# EAGLE design PCB 111000_CA (EAGLE 9.0.1)
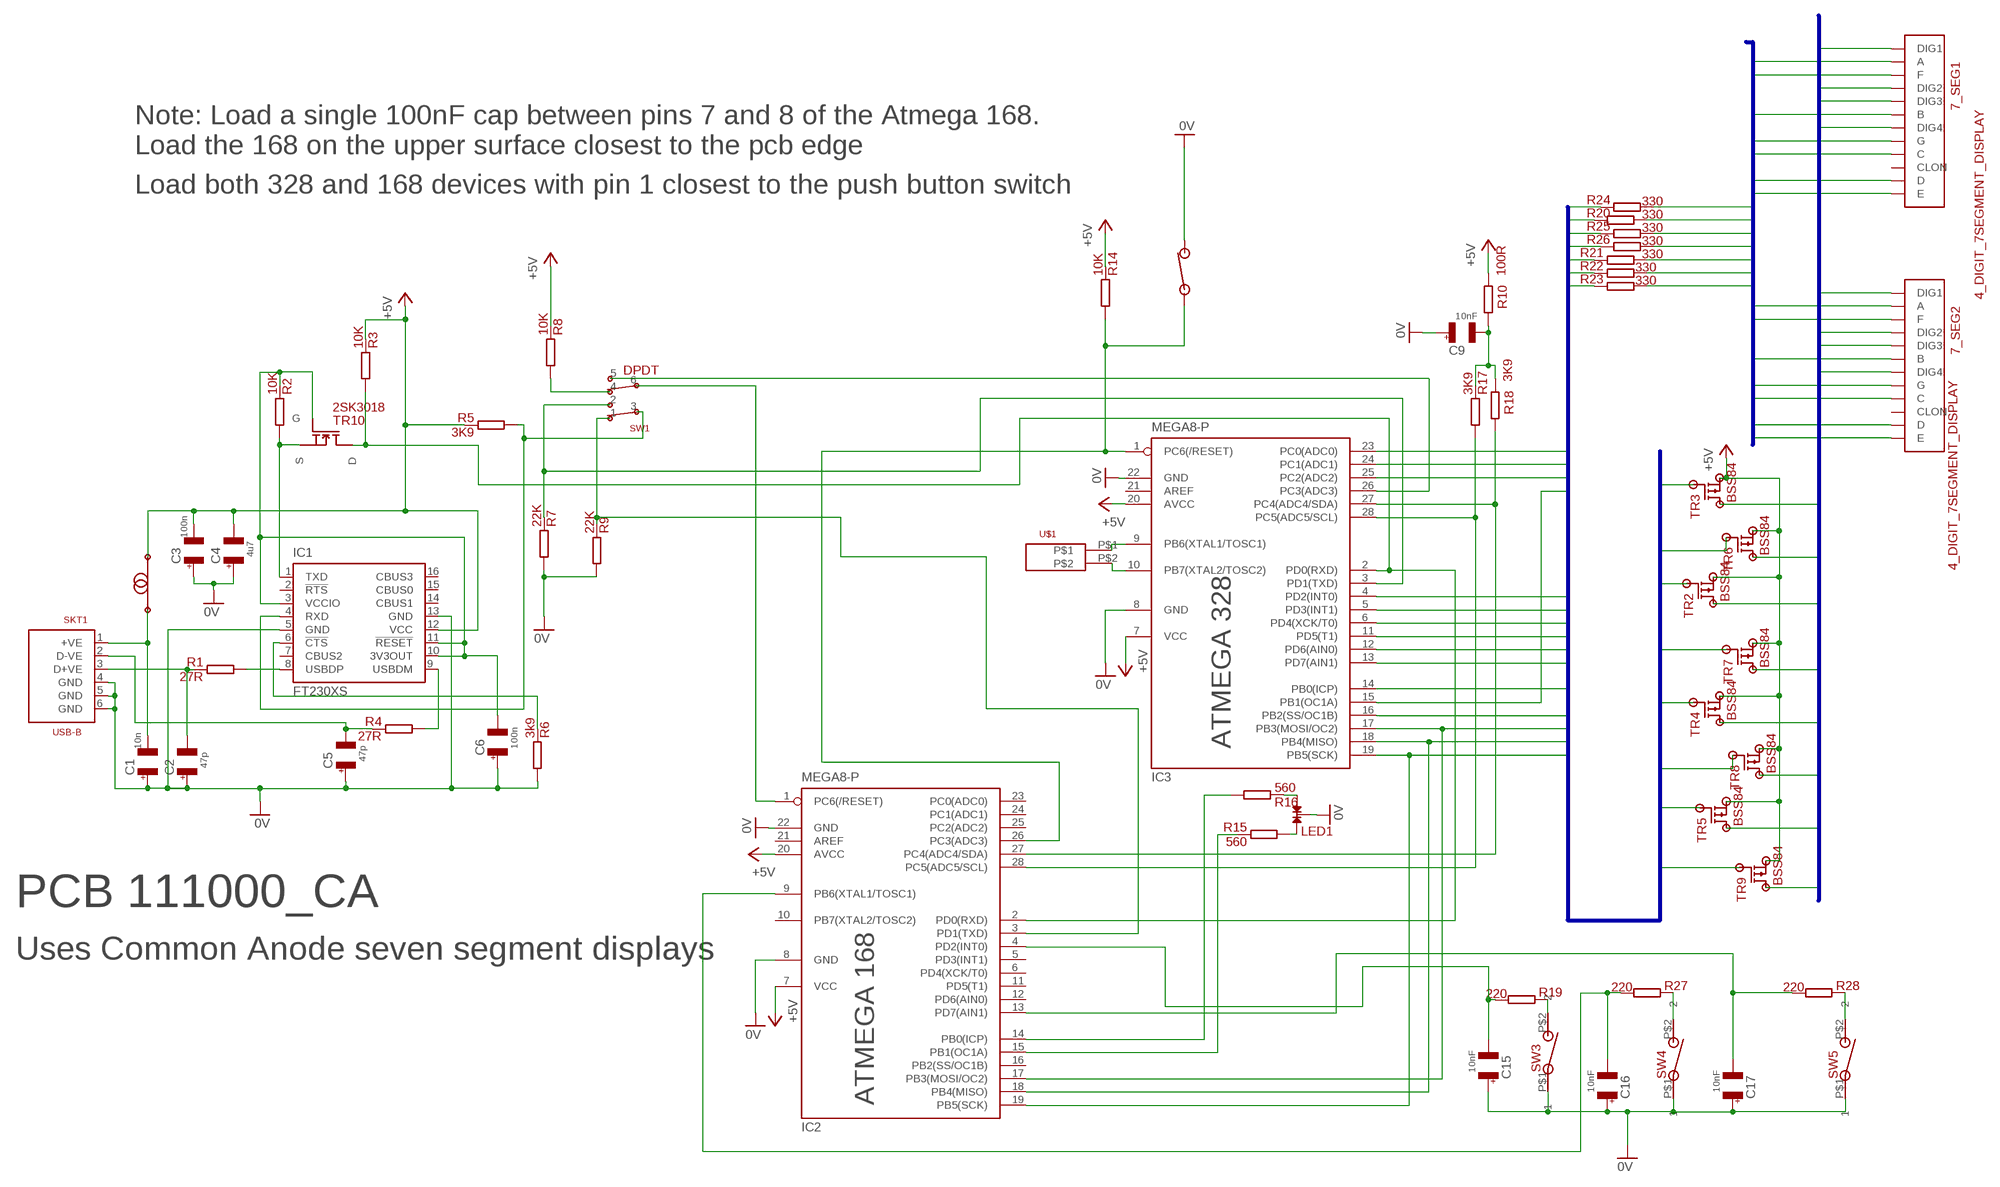
[diagram p0: schematic, sheet 1]

## Parts
7_SEG1  4_DIGIT_7SEGMENT_DISPLAY  [4_DIGIT_7SEGMENT_DISPLAY]
7_SEG2  4_DIGIT_7SEGMENT_DISPLAY  [4_DIGIT_7SEGMENT_DISPLAY]
C1  10n  1206C  [1206]
C2  47p  1206C  [1206]
C3  100n  1206C  [1206]
C4  4u7  1206C  [1206]
C5  47p  1206C  [1206]
C6  100n  1206C  [1206]
C9  10nF  1206C  [1206]
C15  10nF  1206C  [1206]
C16  10nF  1206C  [1206]
C17  10nF  1206C  [1206]
IC1  FT230XS  [SSOP16]
IC2  MEGA8-P  [DIL28-3]
IC3  MEGA8-P  [DIL28-3]
L1  CHOKE  [1206]
LED1  LED  [CA_DUAL_LED]
R1  27R  1206R  [1206]
R2  10K  1206R  [1206]
R3  10K  1206R  [1206]
R4  27R  1206R  [1206]
R5  3K9  1206R  [1206]
R6  3k9  1206R  [1206]
R7  22K  1206R  [1206]
R8  10K  1206R  [1206]
R9  22K  1206R  [1206]
R10  100R  1206R  [1206]
R14  10K  1206R  [1206]
R15  560  1206R  [1206]
R16  560  1206R  [1206]
R17  3K9  1206R  [1206]
R18  3K9  1206R  [1206]
R19  220  1206R  [1206]
R20  330  1206R  [1206]
R21  330  1206R  [1206]
R22  330  1206R  [1206]
R23  330  1206R  [1206]
R24  330  1206R  [1206]
R25  330  1206R  [1206]
R26  330  1206R  [1206]
R27  220  1206R  [1206]
R28  220  1206R  [1206]
SKT1  USB-B  [USB-B]
SW1  DPDT  [DPDT_SWITCH]
SW2  NO_SW  [SM_NO_PUSH_BUTTON]
SW3  NO_PB_1  [RE51-0711]
SW4  NO_PB_1  [RE51-0711]
SW5  NO_PB_1  [RE51-0711]
TR2  BSS84  [SOT23]
TR3  BSS84  [SOT23]
TR4  BSS84  [SOT23]
TR5  BSS84  [SOT23]
TR6  BSS84  [SOT23]
TR7  BSS84  [SOT23]
TR8  BSS84  [SOT23]
TR9  BSS84  [SOT23]
TR10  2SK3018  [2SK3018]
U$1  XTAL  [XTAL_VIAS]

## Nets
0V: C1.P$1 C2.P$1 C3.P$1 C4.P$1 C5.P$1 C6.P$1 C9.P$1 C15.P$1 C16.P$1 C17.P$1 IC1.5(GND) IC1.13(GND) IC2.8(GND) IC2.22(GND) IC3.8(GND) IC3.22(GND) LED1.2 R6.P$1 R7.P$1 R9.P$1 SKT1.4(GND) SKT1.5(GND) SKT1.6(GND) SW2.P$2 SW3.P$1 SW4.P$1 SW5.P$1
+5V: C3.P$2 C4.P$2 IC1.12(VCC) IC2.7(VCC) IC2.20(AVCC) IC3.7(VCC) IC3.20(AVCC) L1.P$2 R3.P$2 R5.P$2 R8.P$2 R10.P$2 R14.P$2 TR2.2(S) TR3.2(S) TR4.2(S) TR5.2(S) TR6.2(S) TR7.2(S) TR8.2(S) TR9.2(S)
DIGIT0: 7_SEG1.P$12(DIG1) TR4.3(D)
DIGIT1: 7_SEG1.P$9(DIG2) TR8.3(D)
DIGIT2: 7_SEG1.P$8(DIG3) TR5.3(D)
DIGIT3: 7_SEG1.P$6(DIG4) TR9.3(D)
DIGIT4: 7_SEG2.P$12(DIG1) TR3.3(D)
DIGIT5: 7_SEG2.P$9(DIG2) TR6.3(D)
DIGIT6: 7_SEG2.P$8(DIG3) TR2.3(D)
DIGIT7: 7_SEG2.P$6(DIG4) TR7.3(D)
DISPLAY_DRIVER0: IC3.15(PB1(OC1A)) R24.P$2
DISPLAY_DRIVER1: IC3.4(PD2(INT0)) R20.P$2
DISPLAY_DRIVER2: IC3.5(PD3(INT1)) R25.P$2
DISPLAY_DRIVER3: IC3.6(PD4(XCK/T0)) R26.P$2
DISPLAY_DRIVER4: IC3.11(PD5(T1)) R21.P$2
DISPLAY_DRIVER5: IC3.12(PD6(AIN0)) R22.P$2
DISPLAY_DRIVER6: IC3.13(PD7(AIN1)) R23.P$2
DISPLAY_DRIVER8: IC3.14(PB0(ICP)) TR3.1(G)
DISPLAY_DRIVER9: IC3.16(PB2(SS/OC1B)) TR6.1(G)
DISPLAY_DRIVER10: IC2.17(PB3(MOSI/OC2)) IC3.17(PB3(MOSI/OC2)) TR2.1(G)
DISPLAY_DRIVER11: IC2.18(PB4(MISO)) IC3.18(PB4(MISO)) TR7.1(G)
DISPLAY_DRIVER12: IC2.19(PB5(SCK)) IC3.19(PB5(SCK)) TR4.1(G)
DISPLAY_DRIVER13: IC3.23(PC0(ADC0)) TR8.1(G)
DISPLAY_DRIVER14: IC3.24(PC1(ADC1)) TR5.1(G)
DISPLAY_DRIVER15: IC3.25(PC2(ADC2)) TR9.1(G)
N$1: IC2.14(PB0(ICP)) R16.P$1
N$2: IC2.15(PB1(OC1A)) R15.P$2
N$3: LED1.1 R15.P$1
N$4: LED1.3 R16.P$2
N$5: IC3.26(PC3(ADC3)) SW1.5
N$6: IC3.3(PD1(TXD)) R7.P$2 SW1.2
N$7: R27.P$2 SW4.P$2
N$8: R19.P$2 SW3.P$2
N$9: C6.P$2 IC1.3(VCCIO) IC1.10(3V3OUT) IC1.11(!RESET) R2.P$2 TR10.2(G)
N$10: IC3.9(PB6(XTAL1/TOSC1)) U$1.P$1
N$11: C17.P$2 IC2.13(PD7(AIN1)) R28.P$1
N$12: IC3.10(PB7(XTAL2/TOSC2)) U$1.P$2
N$13: R8.P$1 SW1.4
N$14: IC2.3(PD1(TXD)) R9.P$2 SW1.1
N$15: IC1.1(TXD) R2.P$1 TR10.1(S)
N$16: R28.P$2 SW5.P$2
N$17: C15.P$2 IC2.4(PD2(INT0)) R19.P$1
N$18: IC1.9(USBDM) R4.P$1
N$19: C16.P$2 IC2.9(PB6(XTAL1/TOSC1)) R27.P$1
N$20: C9.P$2 R10.P$1 R17.P$2 R18.P$2
N$25: IC1.8(USBDP) R1.P$1
N$26: IC2.1(PC6(/RESET)) SW1.6
N$27: C5.P$2 R4.P$2 SKT1.2(D-VE)
N$29: C2.P$2 R1.P$2 SKT1.3(D+VE)
N$30: C1.P$2 L1.P$1 SKT1.1(+VE)
N$31: IC2.26(PC3(ADC3)) IC3.1(PC6(/RESET)) R14.P$1 SW2.P$1
N$34: IC1.6(!CTS) R6.P$2
N$35: IC1.4(RXD) R5.P$1 SW1.3
N$38: IC2.28(PC5(ADC5/SCL)) IC3.28(PC5(ADC5/SCL)) R17.P$1
N$39: IC2.27(PC4(ADC4/SDA)) IC3.27(PC4(ADC4/SDA)) R18.P$1
N$40: IC2.2(PD0(RXD)) IC3.2(PD0(RXD)) R3.P$1 TR10.3(D)
SEVEN_SEG0: 7_SEG1.P$11(A) 7_SEG2.P$11(A) R24.P$1
SEVEN_SEG1: 7_SEG1.P$7(B) 7_SEG2.P$7(B) R20.P$1
SEVEN_SEG2: 7_SEG1.P$4(C) 7_SEG2.P$4(C) R25.P$1
SEVEN_SEG3: 7_SEG1.P$2(D) 7_SEG2.P$2(D) R26.P$1
SEVEN_SEG4: 7_SEG1.P$1(E) 7_SEG2.P$1(E) R21.P$1
SEVEN_SEG5: 7_SEG1.P$10(F) 7_SEG2.P$10(F) R22.P$1
SEVEN_SEG6: 7_SEG1.P$5(G) 7_SEG2.P$5(G) R23.P$1
Unconnected: 7_SEG1.P$3(CLON) 7_SEG2.P$3(CLON) IC1.2(!RTS) IC1.7(CBUS2) IC1.14(CBUS1) IC1.15(CBUS0) IC1.16(CBUS3) IC2.5(PD3(INT1)) IC2.6(PD4(XCK/T0)) IC2.10(PB7(XTAL2/TOSC2)) IC2.11(PD5(T1)) IC2.12(PD6(AIN0)) IC2.16(PB2(SS/OC1B)) IC2.21(AREF) IC2.23(PC0(ADC0)) IC2.24(PC1(ADC1)) IC2.25(PC2(ADC2)) IC3.21(AREF)

## Buses
SEVEN_SEG[0..7]
DISPLAY_DRIVER[0..15]
DIGIT[0..7]

## Notes on the sheet
- Note: Load a single 100nF cap between pins 7 and 8 of the Atmega 168.
  Load the 168 on the upper surface closest to the pcb edge
- Load both 328 and 168 devices with pin 1 closest to the push button switch
- ATMEGA 328
- PCB 111000_CA
- Uses Common Anode seven segment displays
- ATMEGA 168

## Library data of the parts
7_SEG1 7_SEG2 = 1_marko:4_DIGIT_7SEGMENT_DISPLAY: Common Anode RE 55-1674
C1-C6 C9 C15-C17 = 1_Home_library:1206C: 4.7uF RS 538-2335 100nF RS 264-4179
IC1 = 1_3V3_Bootloader:FT230X: USB to BASIC UART IC RS 757-0010
IC2 IC3 = 1_Home_library:MEGA8-P: MICROCONTROLLER 8 Kbytes FLASH, 1 kbytes SRAM, 512 bytes EEPROM, USART, 4-channel 10 bit ADC, 2-channel 8 bit ADC Pin compatible with Atmega48, ATMega88, ATMega168 Source: avr.lbr; OC_FARNELL: unknown; OC_NEWARK: unknown
L1 = 1_Home_library:CHOKE: RS 724-1582 1206 inductor
LED1 = 3_My_prog:LED: RS228-5770
R1-R10 R14-R28 = 1_Home_library:1206R
SKT1 = 3_My_prog:USB-B: RS 515-1967
SW1 = 1_Home_library:DPDT: DPST switch RE 76-0100
SW2 = 1_Home_library:NO_SW: SM NO push button RE 51-0709
SW3-SW5 = 1_3V3_Bootloader:NO_PB_1: RE 51-0711
TR2-TR9 = 1_3V3_Bootloader:BSS84: RS 436-8091P
TR10 = 1_3V3_Bootloader:2SK3018: SM equivalent of 2N7000 RS 694-2812
U$1 = 1_3V3_Bootloader:XTAL: Watch Crystal RS 478-9268

## Board
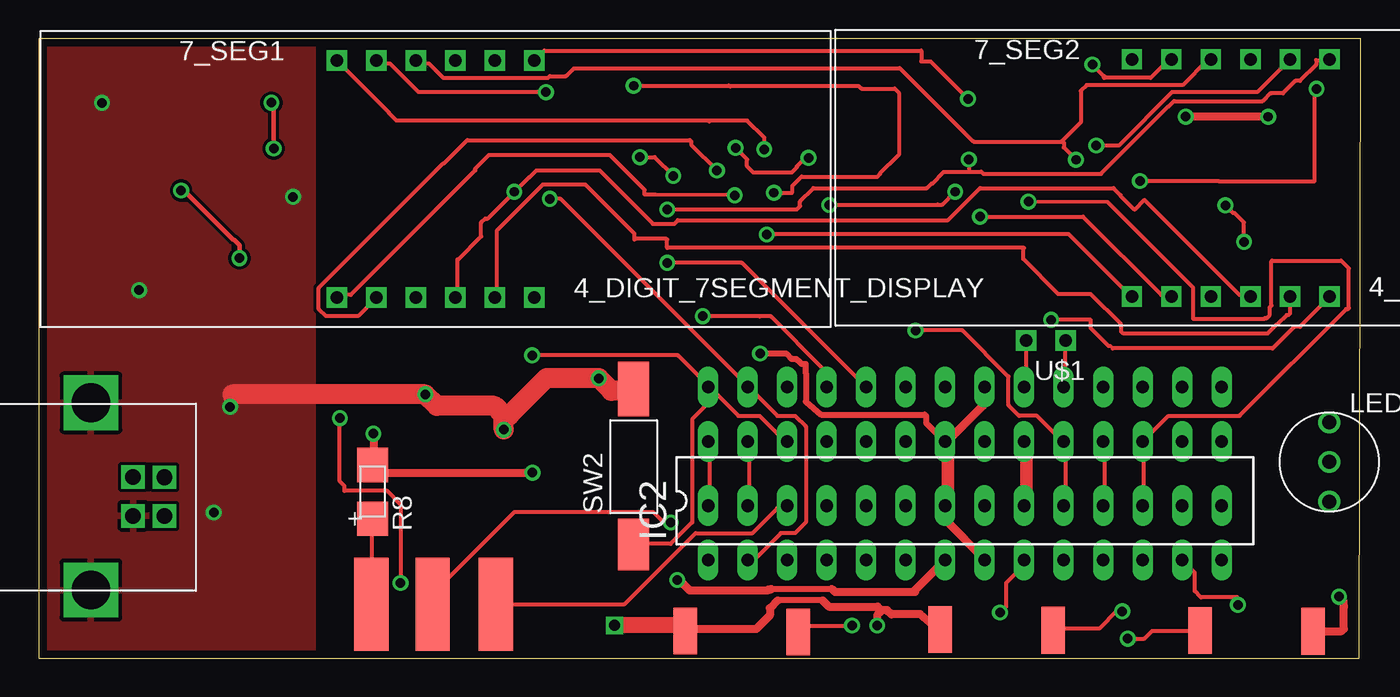
[diagram p1: board, top side]
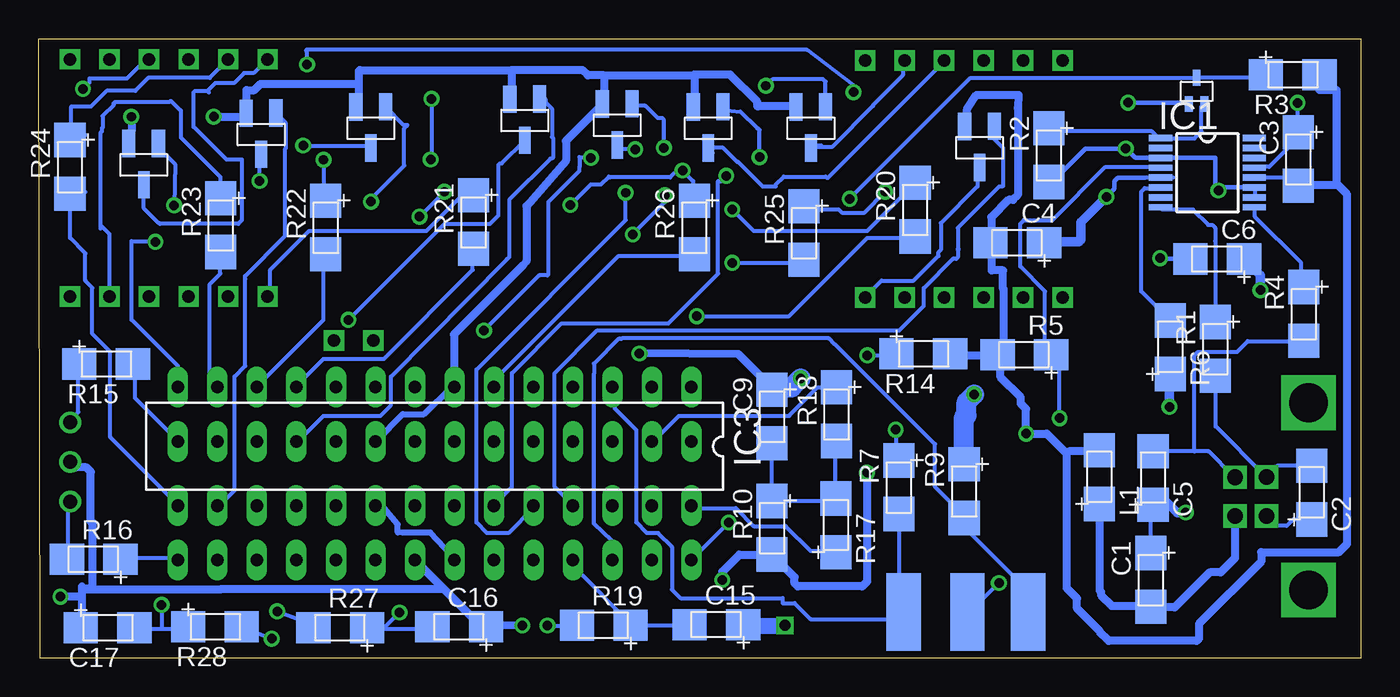
[diagram p2: board, bottom side, seen from below]

Size 85 x 39.8 mm. Coordinates in mm from the lower left corner, seen from the top.
Outline: 0,0 84.9,0 85,39.8 0,39.8 0,0
Copper layers (1*16): Top 0.035mm / dielectric 1.5mm / Bottom 0.035mm
Design rules "default *": minimum track width 10mil, minimum drill 24mil, track to track 8mil, track to pad 8mil, pad to pad 8mil, via to via 8mil, smd to smd 8mil, copper to edge 20mil, drill to drill 8mil, minimum pad ring 10mil, minimum via ring 8mil, stop-mask expansion 4mil, vias tented up to drill 0mil, thermal gap 10mil

### Footprints (pad centres in the part's own frame; a part is rotated, then mirrored left to right if it is on the bottom)
4_DIGIT_7SEGMENT_DISPLAY = drill 0.8 square: P$1 0,0; P$2 2.54,0; P$3 5.08,0; P$4 7.62,0; P$5 10.16,0; P$6 12.7,0; P$7 12.7,15.24; P$8 10.16,15.24; P$9 7.62,15.24; P$10 5.08,15.24; P$11 2.54,15.24; P$12 0,15.24
1206 = smd 2.2 x 2: P$1 -1.75,0; P$2 1.7,0
SSOP16 = smd 1.5 x 0.406: 1 -3.018,2.223; 2 -3.018,1.587; 3 -3.018,0.953; 4 -3.018,0.318; 5 -3.018,-0.318; 6 -3.018,-0.953; 7 -3.018,-1.587; 8 -3.018,-2.223; 9 3.018,-2.223; 10 3.018,-1.587; 11 3.018,-0.953; 12 3.018,-0.318; 13 3.018,0.318; 14 3.018,0.953; 15 3.018,1.587; 16 3.018,2.223
DIL28-3 = drill 0.813 long: 1 -16.51,-3.81; 2 -13.97,-3.81; 3 -11.43,-3.81; 4 -8.89,-3.81; 5 -6.35,-3.81; 6 -3.81,-3.81; 7 -1.27,-3.81; 8 1.27,-3.81; 9 3.81,-3.81; 10 6.35,-3.81; 11 8.89,-3.81; 12 11.43,-3.81; 13 13.97,-3.81; 14 16.51,-3.81; 15 16.51,3.81; 16 13.97,3.81; 17 11.43,3.81; 18 8.89,3.81; 19 6.35,3.81; 20 3.81,3.81; 21 1.27,3.81; 22 -1.27,3.81; 23 -3.81,3.81; 24 -6.35,3.81; 25 -8.89,3.81; 26 -11.43,3.81; 27 -13.97,3.81; 28 -16.51,3.81
CA_DUAL_LED = drill 0.9: 1 0,2.54; 2 0,0; 3 0,-2.54
USB-B = drill 1 square: 1 2.475,0.02; 2 -0.01,0.015; 3 -0.03,-2; 4 2.47,-2 | drill 2.5 square: 5 -4.8,-4.71; 6 7.24,-4.71
DPDT_SWITCH = smd 2.2 x 5: 1 -0.87,1.5; 2 7.13,1.5; 3 3.03,1.5 | smd 2.2 x 6 bottom: 4 -0.87,1; 5 7.13,1; 6 3.07,1
SM_NO_PUSH_BUTTON = smd 3.3 x 2: P$1 -2,1.5 | smd 3.5 x 2: P$2 8,1.5
RE51-0711 = smd 1.5 x 3: P$1 0.77,1.48; P$2 8.03,1.43
SOT23 = smd 0.85 x 1.75: 1 0.56,-2.08; 2 2.47,-2.07 | smd 0.75 x 1.75: 3 1.5,0.57
2SK3018 = smd 0.5 x 1: 1 0.5,-0.8; 2 -0.5,-0.8; 3 0,0.9
XTAL_VIAS = drill 0.8 square: P$1 0,1.27; P$2 0,-1.27

### Placement (x,y rotation side)
7_SEG1  19.16,23.17 0 top
7_SEG2  70.29,23.25 0 top
C1  13.5,5 270 bottom
C2  3.15,10.65 90 bottom
C3  4,32.05 270 bottom
C4  22.1,26.7 180 bottom
C5  13.35,11.6 90 bottom
C6  9.25,25.65 180 bottom
C9  37.85,15.5 270 bottom
C15  41.45,2.15 180 bottom
C16  58,2 180 bottom
C17  80.55,1.95 0 bottom
IC1  9.85,31.2 0 bottom
IC2  59.55,10.1 0 top
IC3  59.55,13.6 180 bottom
L1  16.8,11.65 90 bottom
LED1  82.99,12.6 0 top
R1  9.35,19.85 270 bottom
R2  20.05,32.3 270 bottom
R3  4.35,37.5 0 bottom
R4  3.65,22.1 270 bottom
R5  21.65,19.5 180 bottom
R6  12.25,20 90 bottom
R7  29.7,10.95 270 bottom
R8  21.45,10.7 90 top
R9  25.5,10.7 270 bottom
R10  37.85,8.35 270 bottom
R14  28.1,19.55 0 bottom
R15  80.65,18.9 0 bottom
R16  81.5,6.35 180 bottom
R17  33.75,8.55 90 bottom
R18  33.7,15.65 270 bottom
R19  48.7,2.1 180 bottom
R20  28.65,28.8 270 bottom
R21  57.05,28 270 bottom
R22  66.55,27.65 270 bottom
R23  73.3,27.8 270 bottom
R24  83,31.55 270 bottom
R25  35.8,27.3 270 bottom
R26  42.85,27.65 270 bottom
R27  65.65,1.95 180 bottom
R28  73.65,2 0 bottom
SKT1  8.06,11.61 270 top
SW1  22.25,4.45 180 bottom
SW2  39.75,9.3 90 top
SW3  40.8,0.25 0 top
SW4  57.2,0.35 0 top
SW5  82.7,3.2 180 top
TR2  62.15,33.35 180 bottom
TR3  76.75,31 180 bottom
TR4  46.3,33.55 180 bottom
TR5  33.85,33.35 180 bottom
TR6  69.2,32.95 180 bottom
TR7  52.25,33.85 180 bottom
TR8  40.45,33.35 180 bottom
TR9  23,32.1 180 bottom
TR10  10.55,36.4 0 bottom
U$1  64.75,20.4 90 top

### Tracks (layer width: path | path; a pad name or v marks a point on that pad's centre or on a via)
0V  (via drill 0.61, 0.7)
  Top 0.254: 41.78,1.85 SW3.P$1 41.19,2.11 | 57.78,1.85 SW4.P$1 | 81.78,1.85 SW5.P$1 | 82.93,12.6 LED1.2 | 58.47,9.86 IC3.22 58.47,9.63 | 58.47,13.74 IC2.22 | 60.75,16.26 60.75,17.4 IC3.8 | 58.47,13.97 IC2.22 | 60.75,6.43 IC2.8 | 57.78,13.97 58.24,13.97 IC2.22 | 48.41,19.23 48.41,19.24 | 46.41,19.55 v46.38,19.58 | 54.94,2.82 54.92,2.82 | 56.66,2.82 54.81,2.82 | 38.12,17.17 37.44,16.49 SW2.P$2 38.12,17.17
  Top 0.4: 50.4,3.7 47.5,3.7 | 46.41,19.55 48.1,19.55 48.41,19.24 | 48.41,19.23 48.7,19.23 48.8,19.13 48.83,19.13 49.05,18.91 49.3,18.91 49.3,18.34 49.32,18.31 49.32,16.49 50.31,15.64 56.96,15.64 57.06,15.55 57.06,15.13 IC2.22
  Top 0.5: 41.78,1.85 46.12,1.85 47,2.73 47,3.2 47.5,3.7 | 57.78,1.85 56.66,2.82 54.94,2.82 | 58.47,13.97 60.75,16.26 | 58.47,9.63 58.47,8.71 60.75,6.43 | 50.4,3.7 50.8,3.3 53.93,3.3 54.14,3.09 | 54.55,3.09 54.14,3.09 | 54.14,3.09 54.14,2.98 53.91,2.74 v53.91,2.09 | SW5.P$1 83.77,1.72 83.92,1.88 83.92,3.33 83.92,3.34 83.92,3.63 v83.61,3.94
  Top 0.56: 54.81,2.82 54.55,3.09
  Top 0.61: 12.45,16.95 12.3,17.1 v12.3,16.15
  Top 0.8: 58.47,13.74 58.47,9.86
  Top 1.016: 41.19,2.11 37.03,2.11 v37.02,2.09
  Top 1.27: 12.45,16.95 v24.85,16.95 25.6,16.2 29.3,16.2 29.9,15.6 | v29.9,14.68 29.9,15.6 | 29.9,15.6 30.25,15.6 32.65,18 35.99,18 v36.01,17.98 36.82,17.17 38.12,17.17
  Bottom 0.254: 82.24,2.08 C17.P$1 82.3,3.93 82.28,3.95 | 60.75,6.43 IC2.8 60.82,6.27 58.97,4.41 | 40.63,2.08 39.72,2.08 C15.P$1 | 56.18,1.85 C16.P$1 56.41,2.08 56.64,2.08 56.64,2.11 53.95,2.11 53.92,2.08 v53.92,2.09 | 12.06,30.89 12.75,30.89 IC1.5 12.98,30.89 13.89,30.89 | 7.72,26.54 7.72,25.86 C6.P$1 | 20.29,26.77 C4.P$1 | v29.9,14.68 29.89,12.83 R7.P$1 | 37.66,17.4 C9.P$1 37.89,17.4 | IC1.13 6.8,31.57 5.89,31.57 3.83,33.63 C3.P$1 4.06,33.86 v4.06,35.69 | 2.46,8.71 C2.P$1 4.35,8.9 4.75,8.5 5.45,8.5 5.89,8.94 SKT1.4 6.12,9.17 | 13.66,6.43 C1.P$1 13.5,9.24 13.66,9.4 13.43,9.63 C5.P$1 | 12.75,10.31 13.2,9.86 C5.P$1 | 13.43,9.86 C5.P$1 | 73.34,4.41 73.36,4.4 | 82.24,4.6 81.84,4.6 81.54,4.4 | 81.54,8.72 81.67,8.75 | v83.61,3.95 v83.61,3.94 | 36.97,2.08 v37.02,2.09
  Bottom 0.305: 13.89,30.89 15.61,30.89 15.85,30.65 15.85,30.15 v16.35,29.65
  Bottom 0.5: 82.24,4.6 82.24,4.4 | 82.24,4.4 82.24,2.08 | v46.38,19.58 40.02,19.53 37.89,17.4 | 56.64,2.11 IC2.8 | v53.91,2.09 55.44,2.09 55.46,2.12 56.14,2.12 C16.P$1 | 58.97,4.41 73.34,4.41 | 73.36,4.4 82.24,4.4 | 81.54,4.4 81.54,8.72 | 81.67,8.75 81.67,11.97 81.95,12.26 82.64,12.26 LED1.2 | 82.28,3.95 v83.61,3.95
  Bottom 0.61: 20.29,26.77 18.13,26.77 18,26.9 18,28 v16.35,29.65 | v11.25,9.35 11.78,9.35 12.75,10.31 | v12.3,16.15 12.3,18.2 R6.P$1 | 25.5,15.5 25.4,15.6 25.35,15.6 | v6.45,23.65 6.45,24.6 C6.P$1
  Bottom 1.016: 39.72,2.08 36.97,2.08
  Bottom 1.27: R9.P$1 25.5,15.5 | 25.35,15.6 25.35,16.45 v24.85,16.95 | 37.66,17.4 36.59,17.4 v36.01,17.98
  pour Top: 0.4,40.05 17.6,40.05 17.6,0.5 0.4,0.5
+5V  (via drill 0.61)
  Top 0.254: 21.66,12.37 R8.P$2 | 63.5,9.86 IC3.20 | 63.5,13.74 IC2.20 | 58.24,6.2 IC2.7
  Top 0.4: 47.1,4.45 51,4.45
  Top 0.5: v21.51,14.42 21.51,12.46 R8.P$2 21.48,11.87 31.7,11.87 v31.74,11.91 | v41.05,5.01 41.19,5.01 41.85,4.35 46.85,4.35 46.9,4.4 47.05,4.4 47.1,4.45 | 51,4.45 51.2,4.25 56.35,4.25 56.35,4.36 IC2.7 | v79.05,34.8 v73.75,34.8
  Top 0.8: 63.5,13.74 63.5,9.86
  Bottom 0.254: IC1.12 6.8,30.89 4.52,30.89 4.06,30.43 C3.P$2 | 2.46,37.29 R3.P$2 2.65,36.5 | 3.83,30.43 C3.P$2 | 25.32,34.09 TR9.2 | 23.72,26.77 C4.P$2 23.72,26.54 23.72,26.17 | 26.95,18.97 26.46,19.46 R14.P$2 26.23,19.46 | 16.86,13.28 L1.P$2 | 23.49,19.46 R5.P$2 23.26,19.69 22.95,19.84 | 3.83,30.2 C3.P$2 | 58.47,17.4 IC3.7 | 63.27,13.97 IC2.20 | 37.89,6.43 R10.P$2 37.66,6.43 | 63.27,9.63 IC3.20 | 58.47,6.43 IC2.7 | 71.5,35.23 TR6.2 | 79.04,33.86 79.04,33.17 TR3.2 | 71.95,34.77 71.72,35 TR6.2 | 36.52,35.46 TR5.2 | 48.64,35.69 TR4.2 | 42.92,35.46 TR8.2 | 54.58,36.14 TR7.2 | 48.87,35.69 TR4.2 | 64.41,35.46 TR2.2 | 58.24,17.63 IC3.7 | TR4.2 48.87,35.46 48.89,35.46 | 48.7,35.69 TR4.2 | 71.65,35.95 71.65,35.04 TR6.2 | 1.6,30.43 1.6,30.4 1.55,30.4 1.55,30.5 | 53.65,25.5 53.85,25.3 53.85,25.25 | 58.3,17.43 IC3.7
  Bottom 0.4: 58.47,17.4 60.23,15.68 61.6,15.68 63.27,13.97 | 63.27,9.63 62.81,9.63 61.92,8.58 61.92,8.08 61.62,8.06 59.83,8.06 58.47,6.58 58.47,6.43
  Bottom 0.5: 26.23,19.46 23.49,19.46 | 22.95,19.84 22.95,23.73 23.01,23.73 23.01,24.92 23.72,24.92 23.72,26.17 | v79.05,34.8 79.04,33.86 | 3.83,30.43 1.6,30.43 | 2.65,36.5 1.55,36.5 1.55,30.5 0.86,29.81 0.86,7.34 1.4,6.8 6.4,6.8 6.4,6.2 10.4,2.2 10.4,1.25 10.55,1.1 16.2,1.1 16.8,1.7 16.8,1.75 18.23,3.18 18.23,3.83 18.9,4.5 18.9,13.13 | 16.86,13.28 18.75,13.28 18.9,13.13 | 18.9,13.13 20.19,14.42 v21.51,14.42 21.51,16.01 21.85,16.35 21.85,16.75 23.15,18.05 23.15,19.3 R5.P$2 | v31.74,11.91 31.74,4.91 32.05,4.6 36.2,4.6 36.4,4.8 36.4,5.2 R10.P$2 39.95,6.65 41.05,5.55 v41.05,5.01 | 25.32,34.09 25.32,35.28 24.7,36.2 22,36.2 22.05,35.35 22.05,29.75 22.35,29.45 22.65,29.45 23.75,28.35 23.75,26.75 C4.P$2 | 48.89,35.46 51.1,33.25 51.1,31.95 53.65,29.05 53.65,25.5 | 36.52,35.46 38.76,35.46 38.8,35.5 38.8,35.75 40.55,37.5 42.85,37.5 42.85,37.35 | 42.85,37.35 42.85,35.49 TR8.2 | 48.64,35.69 48.64,37.44 48.65,37.45 | 48.65,37.45 42.95,37.45 42.85,37.35 | 48.65,37.45 49.7,37.45 50.05,37.8 54.6,37.8 | 54.6,37.8 54.6,36.04 TR7.2 | 64.41,35.46 64.41,36.85 | 64.41,36.85 64.41,37.74 64.35,37.8 54.6,37.8 | 71.65,35.95 71.65,36.5 71.15,36.5 70.75,36.9 64.46,36.9 64.41,36.85 | v73.75,34.8 71.89,34.8 TR6.2 | 53.85,25.25 58.3,20.8 58.3,17.43
DIGIT0  (via drill 0.61)
  Top 0.254: 19.38,38.2 7_SEG1.P$12 22.5,35.08 22.5,35.05 23,34.55 43.15,34.55 | 43.1,34.5 43.15,34.55 | v46.65,32.7 46.65,33.45 45.55,34.55 43.15,34.55
  Bottom 0.254: v46.65,32.7 47.52,32.7 TR4.3
DIGIT1
  Bottom 0.254: 41.78,32.72 TR8.3 | 7_SEG1.P$9 26.92,38.2 34.27,30.85 34.3,30.85 34.4,30.95 37.1,30.95 37.6,30.45 37.6,30.3 38.45,30.3 40.05,31.9 40.1,31.9 41,32.8 41.93,32.8 TR8.3 | 41.65,32.48 TR8.3 | 41.78,32.95 TR8.3 | 41.9,32.73 TR8.3
DIGIT2
  Bottom 0.254: 34.69,32.94 35.15,32.94 TR5.3 35.28,32.85 34,32.85 31.35,35.5 31.35,35.55 29.43,37.47 29.43,38.2 7_SEG1.P$8
DIGIT3
  Bottom 0.254: TR9.3 24.63,31.34 24.63,30.32 27,27.95 27,26.23 27.15,26.09 27.15,25.86 28.75,24.26 30.81,24.26 31.72,23.34 7_SEG1.P$6
DIGIT4
  Bottom 0.254: 78.13,30.2 TR3.3 78.25,28.9 77.3,27.95 77.25,27.95 77.22,27.92 72.18,27.92 71.95,28.14 71.95,32.03 72.93,32.03 75.05,34.15 75.05,36.35 74.95,36.45 74.15,36.45 | 70.35,38.43 7_SEG2.P$12 70.31,38.49 71.2,37.6 71.8,37.6 72.45,36.95 73.65,36.95 74.15,36.45 | 74.15,36.45 74.05,36.35
DIGIT5  (via drill 0.61)
  Top 0.254: v70.81,30.66 75.84,30.66 75.85,30.65 82.05,30.65 82.05,36.47 v82.17,36.59
  Bottom 0.254: v70.81,30.66 70.81,32.26 TR6.3 | 7_SEG2.P$9 78.13,38.43 78.17,38.43 79.35,37.25 81.75,37.25 81.75,37.01 v82.17,36.59
DIGIT6  (via drill 0.61)
  Top 0.254: v68,32.94 69.44,32.94 72.87,36.37 78.35,36.37 80.41,38.43 7_SEG2.P$8
  Bottom 0.254: v68,32.94 63.72,32.94 TR2.3
DIGIT7  (via drill 0.61)
  Top 0.254: v65.1,21.74 67.65,21.74 67.65,21.2 68.8,20.05 68.9,20.05 69.05,19.9 79.35,19.9 80.74,21.29 81.1,21.29 82.93,23.12 7_SEG2.P$6
  Bottom 0.254: v65.1,21.74 58.92,27.92 55.98,27.92 55.45,28.45 55.45,31.7 55.35,31.8 55.23,31.8 TR7.3 53.89,33.17
DISPLAY_DRIVER0
  Bottom 0.254: 82.01,29.97 R24.P$2 83,27 82.01,26.01 82.01,24.26 81.56,23.8 81.56,20.83 80.41,19.69 80.41,14.2 76.07,9.86 IC3.15
DISPLAY_DRIVER1  (via drill 0.61)
  Top 0.254: v42.69,21.97 46.35,21.97 46.36,21.97 47.06,21.97 50.47,18.56 50.53,18.56 50.69,18.4 50.69,17.63 IC3.4
  Bottom 0.254: v42.69,21.97 36.75,21.97 31.72,27 28.75,27 R20.P$2
DISPLAY_DRIVER2  (via drill 0.61)
  Top 0.254: v40.41,25.4 45.21,25.4 52.98,17.63 IC3.5
  Bottom 0.254: v40.41,25.4 35.84,25.4 R25.P$2
DISPLAY_DRIVER3
  Bottom 0.254: R26.P$2 42.92,25.86 47.72,25.86 55.95,17.63 IC3.6
DISPLAY_DRIVER4
  Bottom 0.254: R21.P$2 57.09,26.09 57.09,24.94 62.81,19.23 66.7,19.23 68.3,17.63 IC3.11
DISPLAY_DRIVER5
  Bottom 0.254: R22.P$2 66.7,25.86 66.7,21.74 70.81,17.63 IC3.12
DISPLAY_DRIVER6
  Bottom 0.254: R23.P$2 73.33,26.09 73.33,24.72 74.01,24.03 74.01,18.09 73.55,17.63 IC3.13
DISPLAY_DRIVER8  (via drill 0.61)
  Top 0.254: v77.5,26.75 77.5,28 76.9,28.6 76.8,28.6 v76.3,29.1
  Bottom 0.254: TR3.1 77.44,32.94 76.25,31.75 v76.3,29.1 | IC3.14 76.07,17.63 76.07,18.77 79.04,21.74 79.04,26.8 78.99,26.75 v77.5,26.75
DISPLAY_DRIVER9
  Bottom 0.254: 69.9,35 TR6.1 69.1,34.37 69.1,32.8 69.15,32.75 69.15,27.15 71.75,24.55 71.75,24.4 71.72,24.38 71.72,18.77 72.41,18.09 72.41,10.77 73.33,9.86 IC3.16
DISPLAY_DRIVER10  (via drill 0.61)
  Top 0.254: v63.64,29.34 68.75,29.29 74.24,23.8 74.24,21.81 74.25,21.8 78.8,21.8 78.85,21.85 78.95,21.85 79.15,22.05 79.15,22.54 79.27,22.66 79.27,25.52 79.3,25.55 83.75,25.55 84.25,25.05 84.25,22.5 84.18,22.43 84.07,22.43 77.21,15.57 72.64,15.57 71.04,13.97 IC2.17 71.04,13.74 71.04,9.86 IC3.17
  Bottom 0.254: 62.81,35.23 TR2.1 61.53,34.25 61.3,34.25 61.5,34.05 61.5,31.65 63.64,29.51 v63.64,29.34
DISPLAY_DRIVER11
  Top 0.254: IC3.18 68.53,9.86 68.53,13.74 IC2.18
  Bottom 0.254: 52.98,35.92 TR7.1 52.43,35.93 52.43,35.73 52,35.3 52,33.5 51.95,33.45 51.95,32.15 52,32.1 52.1,32.1 54.75,29.45 54.75,25.79 54.89,25.64 62.35,18.09 62.35,16.26 63.04,15.57 66.7,15.57 68.3,13.97 IC2.18
DISPLAY_DRIVER12  (via drill 0.61)
  Top 0.254: v56.37,21.06 59.38,21.06 62.35,18.09 62.35,16.26 63.04,15.57 64.18,15.57 65.78,13.97 IC2.19 66.01,13.74 66.01,9.86 IC3.19 | v49.5,32.15 49.3,32.15 48.75,31.6 48.75,31.55 48.4,31.2 45.95,31.2 45.55,31.6 45.55,32.05 v44.8,32.8
  Bottom 0.254: 47.04,35.46 TR4.1 46.73,35.5 46,35.5 45.2,34.7 44.9,34.7 44.8,34.6 v44.8,32.8 | v49.5,32.15 50.19,32.15 50.24,32.2 50.24,31.56 50.25,31.55 50.25,31.3 52.25,29.3 52.25,24.65 52.3,24.6 52.83,24.6 v56.37,21.06
DISPLAY_DRIVER13  (via drill 0.61)
  Top 0.254: v38.65,32.2 39.6,32.2 v40.8,31
  Bottom 0.254: TR8.1 41.09,35.23 39.88,35.13 38.8,34.05 38.75,34.05 38.65,33.95 v38.65,32.2 | IC3.23 55.72,9.86 54.58,11 54.58,18.31 51.38,21.52 44.52,21.52 41.32,24.72 41.32,30.66 41.14,30.66 v40.8,31
DISPLAY_DRIVER14  (via drill 0.61)
  Top 0.254: v38.25,36.8 v38.25,36.79 44.36,36.79 44.45,36.75 52.75,36.75 52.9,36.6 55.05,36.6 55.3,36.35 55.3,32.35 54.1,31.15 54.1,31.1 53.95,30.95 49.05,30.95 48.45,30.35 48.45,29.95 48.41,29.91 v47.27,29.91 | v38.25,36.8
  Bottom 0.254: v47.27,29.91 47.27,28.14 56.87,18.54 56.87,8.71 56.18,8.03 54.81,8.03 53.21,9.63 IC3.24 | 34.46,35.23 TR5.1 34.41,37.06 34.55,37.2 37.84,37.2 v38.25,36.79
DISPLAY_DRIVER15
  Bottom 0.254: 23.72,34.32 TR9.1 23.56,33.36 23,32.8 23,30.35 23.05,30.3 23.25,30.3 25.9,27.65 25.9,26.3 25.85,26.25 25.85,26.3 25.9,26.25 25.9,25.75 26,25.65 26.21,25.65 28.09,23.77 28.09,22.63 29.66,21.06 49.09,21.06 51.84,18.31 51.84,11 50.69,9.86 IC3.25
N$1
  Bottom 0.254: R16.P$1 79.73,6.43 76.07,6.43 IC2.14
N$2
  Bottom 0.254: R15.P$2 78.81,18.77 78.81,16.71 76.07,13.97 IC2.15
N$3
  Bottom 0.254: R15.P$1 82.47,18.77 82.47,15.8 82.93,15.34 LED1.1
N$4
  Bottom 0.254: R16.P$2 83.16,6.43 83.16,9.86 LED1.3
N$5
  Top 0.254: IC3.26 47.95,9.63 47.49,9.63 45.89,8.03 42.24,8.03 37.66,3.45 29.43,3.45 SW1.5
N$6
  Bottom 0.254: 29.66,4.6 29.66,3.23 29.43,3 SW1.2 | 29.66,4.6 29.66,9.17 R7.P$2 | IC3.3 47.95,17.4 47.95,16.03 46.58,14.66 46.58,8.71 45.89,8.03 45.18,8.03 44.3,7.15 44.3,4.4 43.75,3.85 37.18,3.85 37.18,3.53 36.41,3.53 35.38,2.5 30.37,2.5 30.1,2.23 | 29.66,4.6 SW1.2 | 30.15,1.45 30.1,1.5 30.1,2.23 | 30.1,2.23 SW1.2
N$7  (via drill 0.61)
  Top 0.254: 65.32,1.85 SW4.P$2 65.33,1.88 68.19,1.88 69.3,3 v69.67,3
  Bottom 0.254: v69.67,3 67.15,2.08 R27.P$2
N$8  (via drill 0.61)
  Top 0.254: v52.29,2.08 49.09,2.08 48.87,1.85 SW3.P$2
  Bottom 0.254: v52.29,2.08 50.47,2.08 R19.P$2
N$9  (via drill 0.61)
  Top 0.305: v15.1,32.75 15.1,35.55 v14.95,35.7 | v9.15,30.05 9.35,30.05 12.5,26.9 12.55,26.9 12.9,26.55 v12.9,25.7
  Bottom 0.254: IC1.10 6.8,29.74 6.8,30.2 IC1.11 | 11.15,35.69 TR10.2 11.15,35.46 | 20.06,30.66 R2.P$2
  Bottom 0.305: 11.15,35.69 14.94,35.69 v14.95,35.7 | 20.06,30.66 19.79,30.66 17.7,32.75 v15.1,32.75 14.5,32.15 IC1.3 9.35,32.15 9.35,30.25 v9.15,30.05 8.95,30.25 IC1.11 | C6.P$2 12.85,25.65 v12.9,25.7
N$10
  Top 0.254: U$1.P$1 63.5,20.37 63.5,17.63 IC3.9
N$11  (via drill 0.61)
  Top 0.254: v77.11,3.42 77.11,3.86 77.06,3.91 74.73,3.91 74.33,4.31 74.33,5.48 IC2.13
  Bottom 0.254: 77.08,1.85 75.61,1.85 R28.P$1 75.38,2.08 | 77.08,1.85 78.81,1.85 C17.P$2 | v77.11,3.42 77.11,1.89 77.08,1.85
N$12
  Top 0.254: U$1.P$2 66.01,20.37 66.01,17.63 IC3.10
N$13
  Top 0.254: R8.P$1 21.43,8.94 21.43,3.45 SW1.4
N$14
  Bottom 0.254: SW1.1 21.43,3 21.43,4.37 25.32,8.26 25.32,8.94 R9.P$2 25.55,9.17 27.38,11 27.38,13.74 33.78,20.14 33.79,20.14 34.2,20.55 47.5,20.55 47.54,20.51 47.72,20.51 49.3,18.92 49.3,18.27 49.32,18.25 49.32,8.65 48.18,7.57 48.18,6.43 IC2.3
N$15
  Bottom 0.254: TR10.1 10.23,35.46 10.23,33.86 10.69,33.4 12.75,33.4 IC1.1 12.98,33.4 13.43,33.86 19.83,33.86 R2.P$1
N$16  (via drill 0.61)
  Top 0.254: 74.47,1.85 SW5.P$2 74.65,1.75 71.59,1.75 71.08,1.24 v70.02,1.24
  Bottom 0.254: 71.95,2.08 R28.P$2 71.82,1.87 v70.02,1.24
N$17
  Bottom 0.254: C15.P$2 43.15,2.08 46.81,2.08 R19.P$1 47.04,2.31 50.47,5.74 50.47,6.2 IC2.4
N$18
  Bottom 0.254: IC1.9 6.8,28.83 6.8,28.37 3.83,25.4 3.83,24.03 R4.P$1
N$19  (via drill 0.61)
  Top 0.254: v61.81,2.93 62.19,3.31 62.19,4.82 63.5,6.12 63.5,6.2 63.4,6.29 IC2.9
  Bottom 0.254: 62.89,1.85 59.84,1.85 C16.P$2 | 63.5,1.85 63.72,1.85 R27.P$1 63.5,1.85 | 63.5,1.85 62.89,1.85 | 62.89,1.85 v61.81,2.93
N$20
  Bottom 0.254: C9.P$2 37.89,13.74 37.89,10.31 R10.P$1 37.66,10.09 33.78,10.09 R17.P$2 33.78,10.31 33.78,13.74 R18.P$2
N$25
  Bottom 0.254: IC1.8 12.75,28.83 10.78,28.83 9.8,27.85 9.55,27.85 9.35,27.65 9.35,26.81 9.32,26.77 9.32,21.74 R1.P$1
N$26  (via drill 0.61)
  Top 0.254: v40.63,8.71 40.18,8.71 39.49,9.4 30.58,9.4 25.55,4.37 25.55,3.45 SW1.6
  Bottom 0.254: v40.63,8.71 42.92,6.43 IC2.1
N$27
  Bottom 0.254: 10.69,13.28 9.77,13.28 8.17,11.69 SKT1.2 | 10.69,13.28 13.2,13.28 C5.P$2 | 10.69,13.28 10.69,19.46 10.46,19.69 7.95,19.69 7.26,20.37 3.83,20.37 R4.P$2
N$29
  Bottom 0.254: 5.66,11.91 5.89,11.69 SKT1.3 | 2.46,11.91 C2.P$2 5.35,12.35 SKT1.3 | R1.P$2 9.32,18.09 9.32,14.88 6.12,11.69 SKT1.3 | 5.75,11.95 SKT1.3
N$30
  Bottom 0.254: 13.89,3.68 13.89,3.23 | 13.89,3.23 13.89,2.77 C1.P$2 13.89,3.23 | 16.63,9.86 L1.P$1
  Bottom 0.5: L1.P$1 16.8,4.35 16.7,4.25 16.7,4.05 16,3.35 13.55,3.35 C1.P$2 13.45,3.25 11.95,3.25 9.7,5.5 9,5.5 8.08,6.42 SKT1.1
N$31  (via drill 0.61)
  Top 0.254: v31.72,19.46 41.09,19.46 42.92,17.63 IC3.1 | 43.61,16.94 43.15,17.4 IC3.1 | 43.61,16.94 44.98,15.57 46.35,15.57 47.95,13.97 IC2.26 | 43.61,16.94 42.01,15.34 42.01,8.71 40.63,7.34 38.35,7.34 SW2.P$1 | 43.61,16.94 IC3.1
  Bottom 0.254: v31.72,19.46 29.89,19.46 R14.P$1
N$34
  Bottom 0.254: IC1.6 12.98,30.2 13.89,30.2 14.12,29.97 14.12,23.57 12.29,21.74 R6.P$2
N$35  (via drill 0.61)
  Top 0.254: v23.26,4.83 23.26,9.86 22.35,10.77 19.67,10.77 19.65,10.75 19.65,11.05 19.35,11.35 v19.35,15.41 v19.36,15.42
  Bottom 0.254: IC1.4 12.98,31.57 16.4,31.57 19.83,28.14 21.66,28.14 21.89,27.92 21.89,25.17 20.29,23.57 20.29,19.91 20.06,19.69 R5.P$1 | v23.26,4.83 25.09,3 SW1.3 | 20.06,19.46 R5.P$1 | v19.36,15.42 19.36,18.96 R5.P$1
  Bottom 0.305: 20.06,19.34 R5.P$1
N$38
  Top 0.254: IC2.28 43.15,13.74 43.15,9.86 IC3.28
  Bottom 0.254: R17.P$1 33.78,6.88 35.38,6.88 36.98,8.48 39.03,8.48 40.18,9.63 42.92,9.63 IC3.28
N$39
  Top 0.254: IC3.27 45.66,9.86 45.66,13.74 IC2.27
  Bottom 0.254: R18.P$1 34.92,17.4 36.75,15.57 43.84,15.57 45.44,13.97 IC2.27
N$40  (via drill 0.61)
  Top 0.254: IC2.2 45.66,6.43 46.12,6.43 47.72,8.03 48.64,8.03 49.32,8.71 49.32,14.88 48.64,15.57 47.49,15.57 45.66,17.4 IC3.2 45.44,17.63 33.55,29.52 v32.86,29.52
  Bottom 0.254: R3.P$1 6.12,37.29 10.46,37.29 TR10.3 10.69,37.29 25.09,37.29 v32.86,29.52
SEVEN_SEG0  (via drill 0.61)
  Top 0.254: v32.61,36.37 24.41,36.37 22.58,38.2 21.89,38.2 7_SEG1.P$11 | 7_SEG2.P$11 72.64,38.43 71.5,37.29 68.5,37.29 68.5,37.41 v67.75,38.15
  Bottom 0.254: 82.01,33.63 R24.P$1 82.95,33.35 82.95,35.4 82.9,35.45 81.65,35.45 80.65,36.45 78.8,36.45 77.96,37.29 74.01,37.29 72.87,38.43 7_SEG2.P$11 | v32.61,36.37 32.61,36.81 35.6,39.1 67.8,39.1 67.75,38.9 v67.75,38.15
SEVEN_SEG1  (via drill 0.61)
  Top 0.254: v40.41,28.83 48.73,28.83 48.95,29.05 48.95,29.35 49.8,30.2 57.1,30.2 57.4,30.5 57.45,30.5 58.2,31.25 59.75,31.25 | 7_SEG2.P$7 82.93,38.43 82.14,38.43 82.14,38.14 81.1,37.1 80.81,37.1 80,36.3 79.25,36.3 79.2,36.3 78.7,35.8 73,35.8 72.66,35.46 72.64,35.46 68.3,31.12 60.75,31.12 60.6,31.27 60.58,31.25 59.75,31.25 | 7_SEG1.P$7 32.5,39.05 56.75,39.05 56.75,38.35 57.35,38.35 v59.75,35.95 | v59.8,32.05 59.8,31.3 59.75,31.25
  Bottom 0.254: v40.41,28.83 39.03,27.46 31.72,27.46 28.75,30.43 R20.P$1 | v59.75,35.95 59.75,32.1 v59.8,32.05
SEVEN_SEG2  (via drill 0.61)
  Top 0.254: 7_SEG1.P$4 26.92,23.34 26.92,25.63 26.98,25.63 28.45,27.1 28.45,28 28.7,28.25 28.85,28.25 v30.58,29.97 31.49,30.89 31.54,30.89 32,31.35 36.06,31.35 39.49,27.92 40.86,27.92 41.09,28.14 58.47,28.14 60.52,30.2 69.1,30.2 69.55,29.75 69.55,29.7 70.4,28.85 70.5,28.85 71.1,29.45 77.21,23.34 77.9,23.34 7_SEG2.P$4
  Bottom 0.254: v30.58,29.97 31.95,28.6 33.32,28.6 33.55,28.83 35.61,28.83 R25.P$1
SEVEN_SEG3  (via drill 0.61)
  Top 0.254: 7_SEG1.P$2 21.66,23.12 20.52,21.97 18.46,21.97 18,22.43 18,23.8 26.01,31.8 26.05,31.8 27.55,33.3 41.85,33.3 41.95,33.2 41.95,33 v43.61,31.34 v43.6,31.35 | v60.52,28.37 67.15,28.37 72.18,23.34 72.64,23.34 7_SEG2.P$2 | v50.82,29.12 57.77,29.12 57.8,29.15 58.1,29.15 v58.92,29.97
  Bottom 0.254: R26.P$1 42.92,29.52 42.92,30.66 v43.61,31.34 43.84,31.57 43.84,31.46 44.4,30.9 48.3,30.9 48.35,30.95 48.85,30.44 49.5,30.44 v50.82,29.12 | v58.92,29.97 v60.52,28.37
SEVEN_SEG4  (via drill 0.61)
  Top 0.254: v44.75,29.74 39.63,29.79 38.96,29.79 38.95,29.8 38.95,30.1 36.7,32.35 28.95,32.35 28.06,31.46 28.06,31.34 20.06,23.34 19.38,23.34 7_SEG1.P$1 | v46.81,27.23 66.24,27.23 70.12,23.34 7_SEG2.P$1
  Bottom 0.254: R21.P$1 57.09,29.74 57.78,29.74 60.07,27.46 67.61,27.46 70.12,24.94 70.12,23.34 7_SEG2.P$1 | v44.75,29.74 44.75,29.29 v46.81,27.23
SEVEN_SEG5  (via drill 0.61)
  Top 0.254: 7_SEG2.P$10 75.15,38.43 73.55,36.83 67.38,36.83 67,36.45 67,34.44 65.75,33.19 | 7_SEG1.P$10 24.41,38.2 25.09,38.2 26.01,37.29 32.74,37.29 32.85,37.4 33.9,37.4 34.4,37.9 55.31,37.9 55.35,37.94 60.1,33.19 65.75,33.19 | 65.75,33.19 65.86,33.19 65.9,33.15 65.9,32.83 v66.7,32.03
  Bottom 0.254: v66.7,32.03 66.7,29.52 R22.P$1
SEVEN_SEG6
  Top 0.254: 7_SEG1.P$5 29.43,23.34 29.43,27.46 32.41,30.43 35.15,30.43 38.3,27.28 38.3,26.9 38.35,26.95 40.35,26.95 40.41,26.89 40.41,26.36 63.35,26.36 63.3,26.27 63.3,25.65 65.55,23.4 67.65,23.4 69.6,21.45 69.6,21 69.75,20.85 79,20.85 79.6,21.45 79.65,21.45 80.25,22.05 80.35,22.05 80.45,22.15 7_SEG2.P$5
  Bottom 0.254: R23.P$1 73.33,29.74 73.33,30.92 75.85,33.45 75.85,35.2 75.9,35.2 76.5,35.8 76.55,35.8 76.6,35.75 80.1,35.75 80.2,35.65 80.2,35.55 80.9,34.85 80.9,34.1 80.94,34.06 80.94,33.86 81.05,33.75 81.05,27.85 | 81.05,27.85 81.05,27.6 | 7_SEG2.P$5 80.45,27.25 81.05,27.85